# EAGLE schematic 555_Timer (EAGLE 9.1.3)
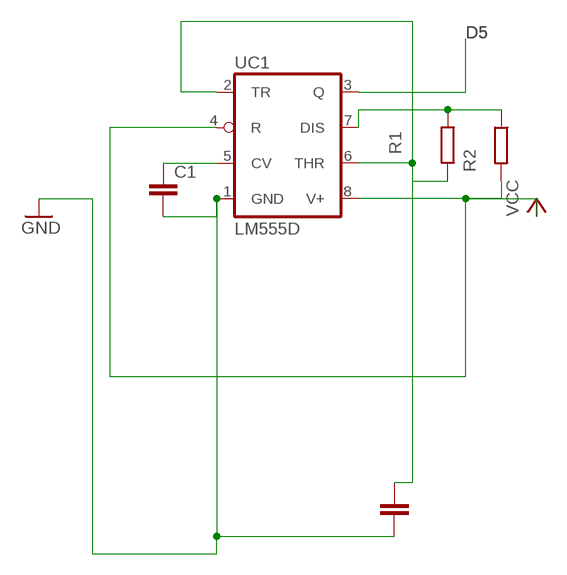
[diagram p0: schematic, sheet 1]

## Parts
C1  C-EU025-024X044  [C025-024X044]
C3  C-EU025-024X044  [C025-024X044]
R1  R-EU_0204/5  [0204/5]
R2  R-EU_0204/5  [0204/5]
UC1  LM555D  [SO08]

## Nets
D5: UC1.3(Q)
GND: C1.2 C3.2 UC1.1(GND)
N$1: R1.2 R2.1 UC1.7(DIS)
N$2: C3.1 R1.1 UC1.2(TR) UC1.6(THR)
N$6: C1.1 UC1.5(CV)
VCC: R2.2 UC1.4(R) UC1.8(V+)

## Library data of the parts
C1 C3 = rcl:C-EU: CAPACITOR, European symbol; SPICEPREFIX: C
R1 R2 = rcl:R-EU_: RESISTOR, European symbol; SPICEPREFIX: R
UC1 = linear:*555: TIMER